# Altium schematic sheet TEMPLATE_overview.SchDoc
size Tabloid; Date: Date; Author: Author 1; Revision: 1; SheetNumber: 2; SheetTotal: 3; Size: 11x17; Sheet_Name: Schéma fonctionnel
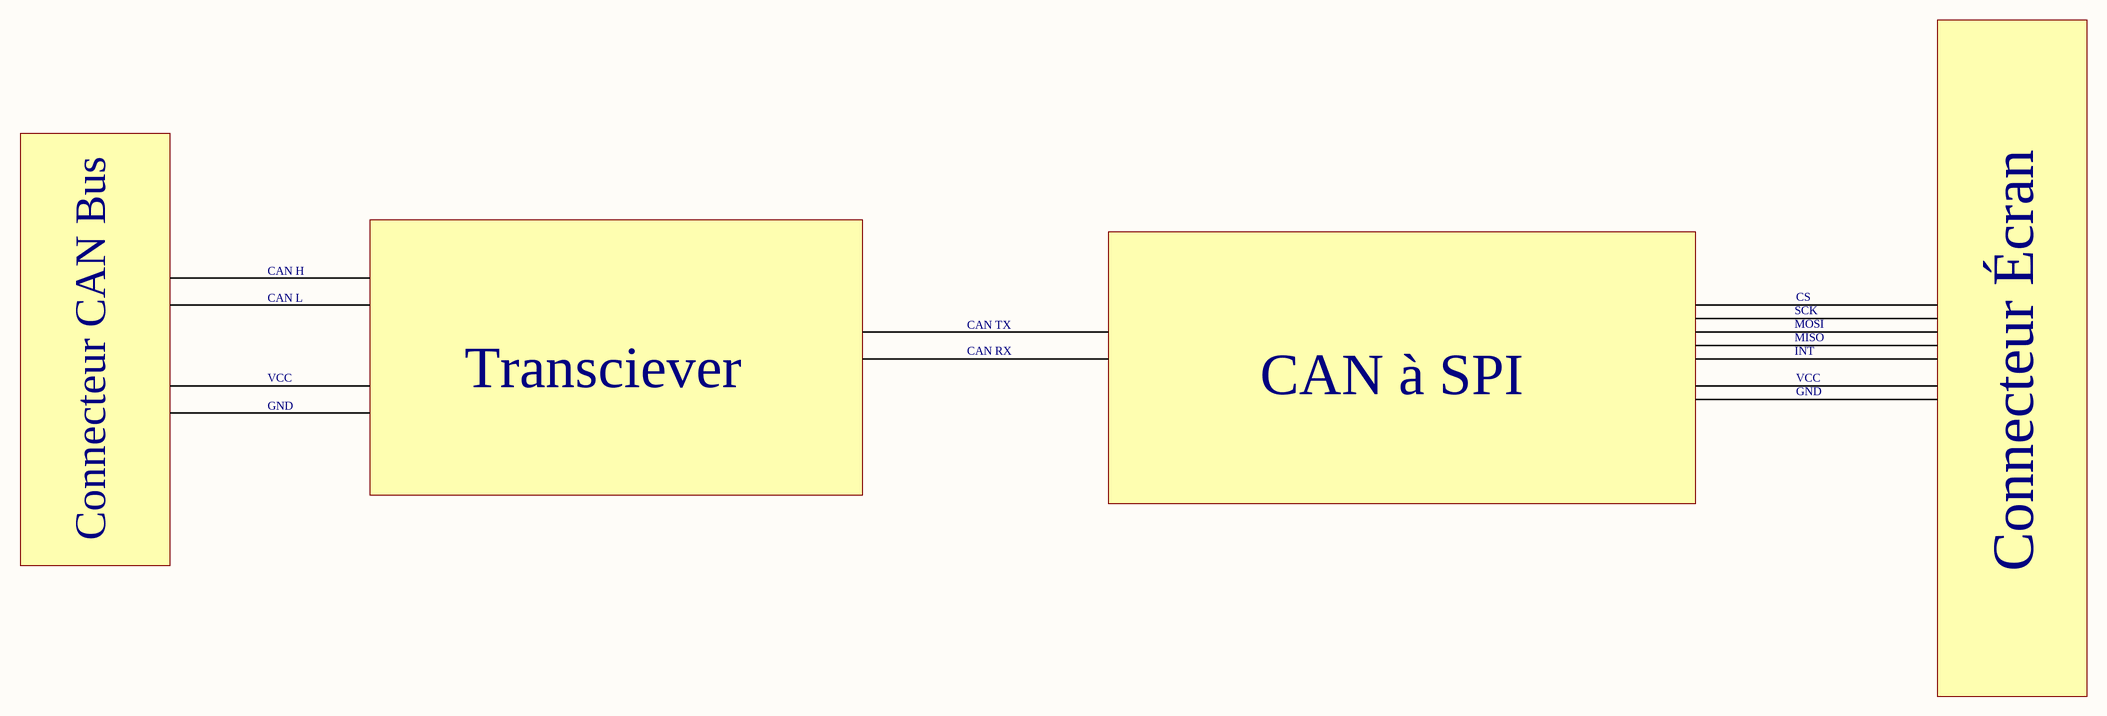
[diagram p0: TEMPLATE_overview.SchDoc]

## Notes on the sheet
- CAN H
- CAN L
- CS
- CAN TX
- CAN RX
- SCK
- MOSI
- MISO
- INT
- VCC
- GND
- Transciever
- CAN à SPI
- Connecteur CAN Bus
- Connecteur Écran
- Nom de la feuille
- Titre du projet
- Cours associé au projet
- Taille
- Département
- Technologies du
- Révision
- PCB
- .
- SCH
- Date
- génie électrique
- Feuille
- Variant
- de
- Concepteurs